# EasyEDA schematic USBMicro_SCH.json
TITLE: Sheet_1; REV: 1.0; Date: 2022-03-17; Sheet: 1/1; Drawn By: Anthony Tricarichi; Company: Your Company
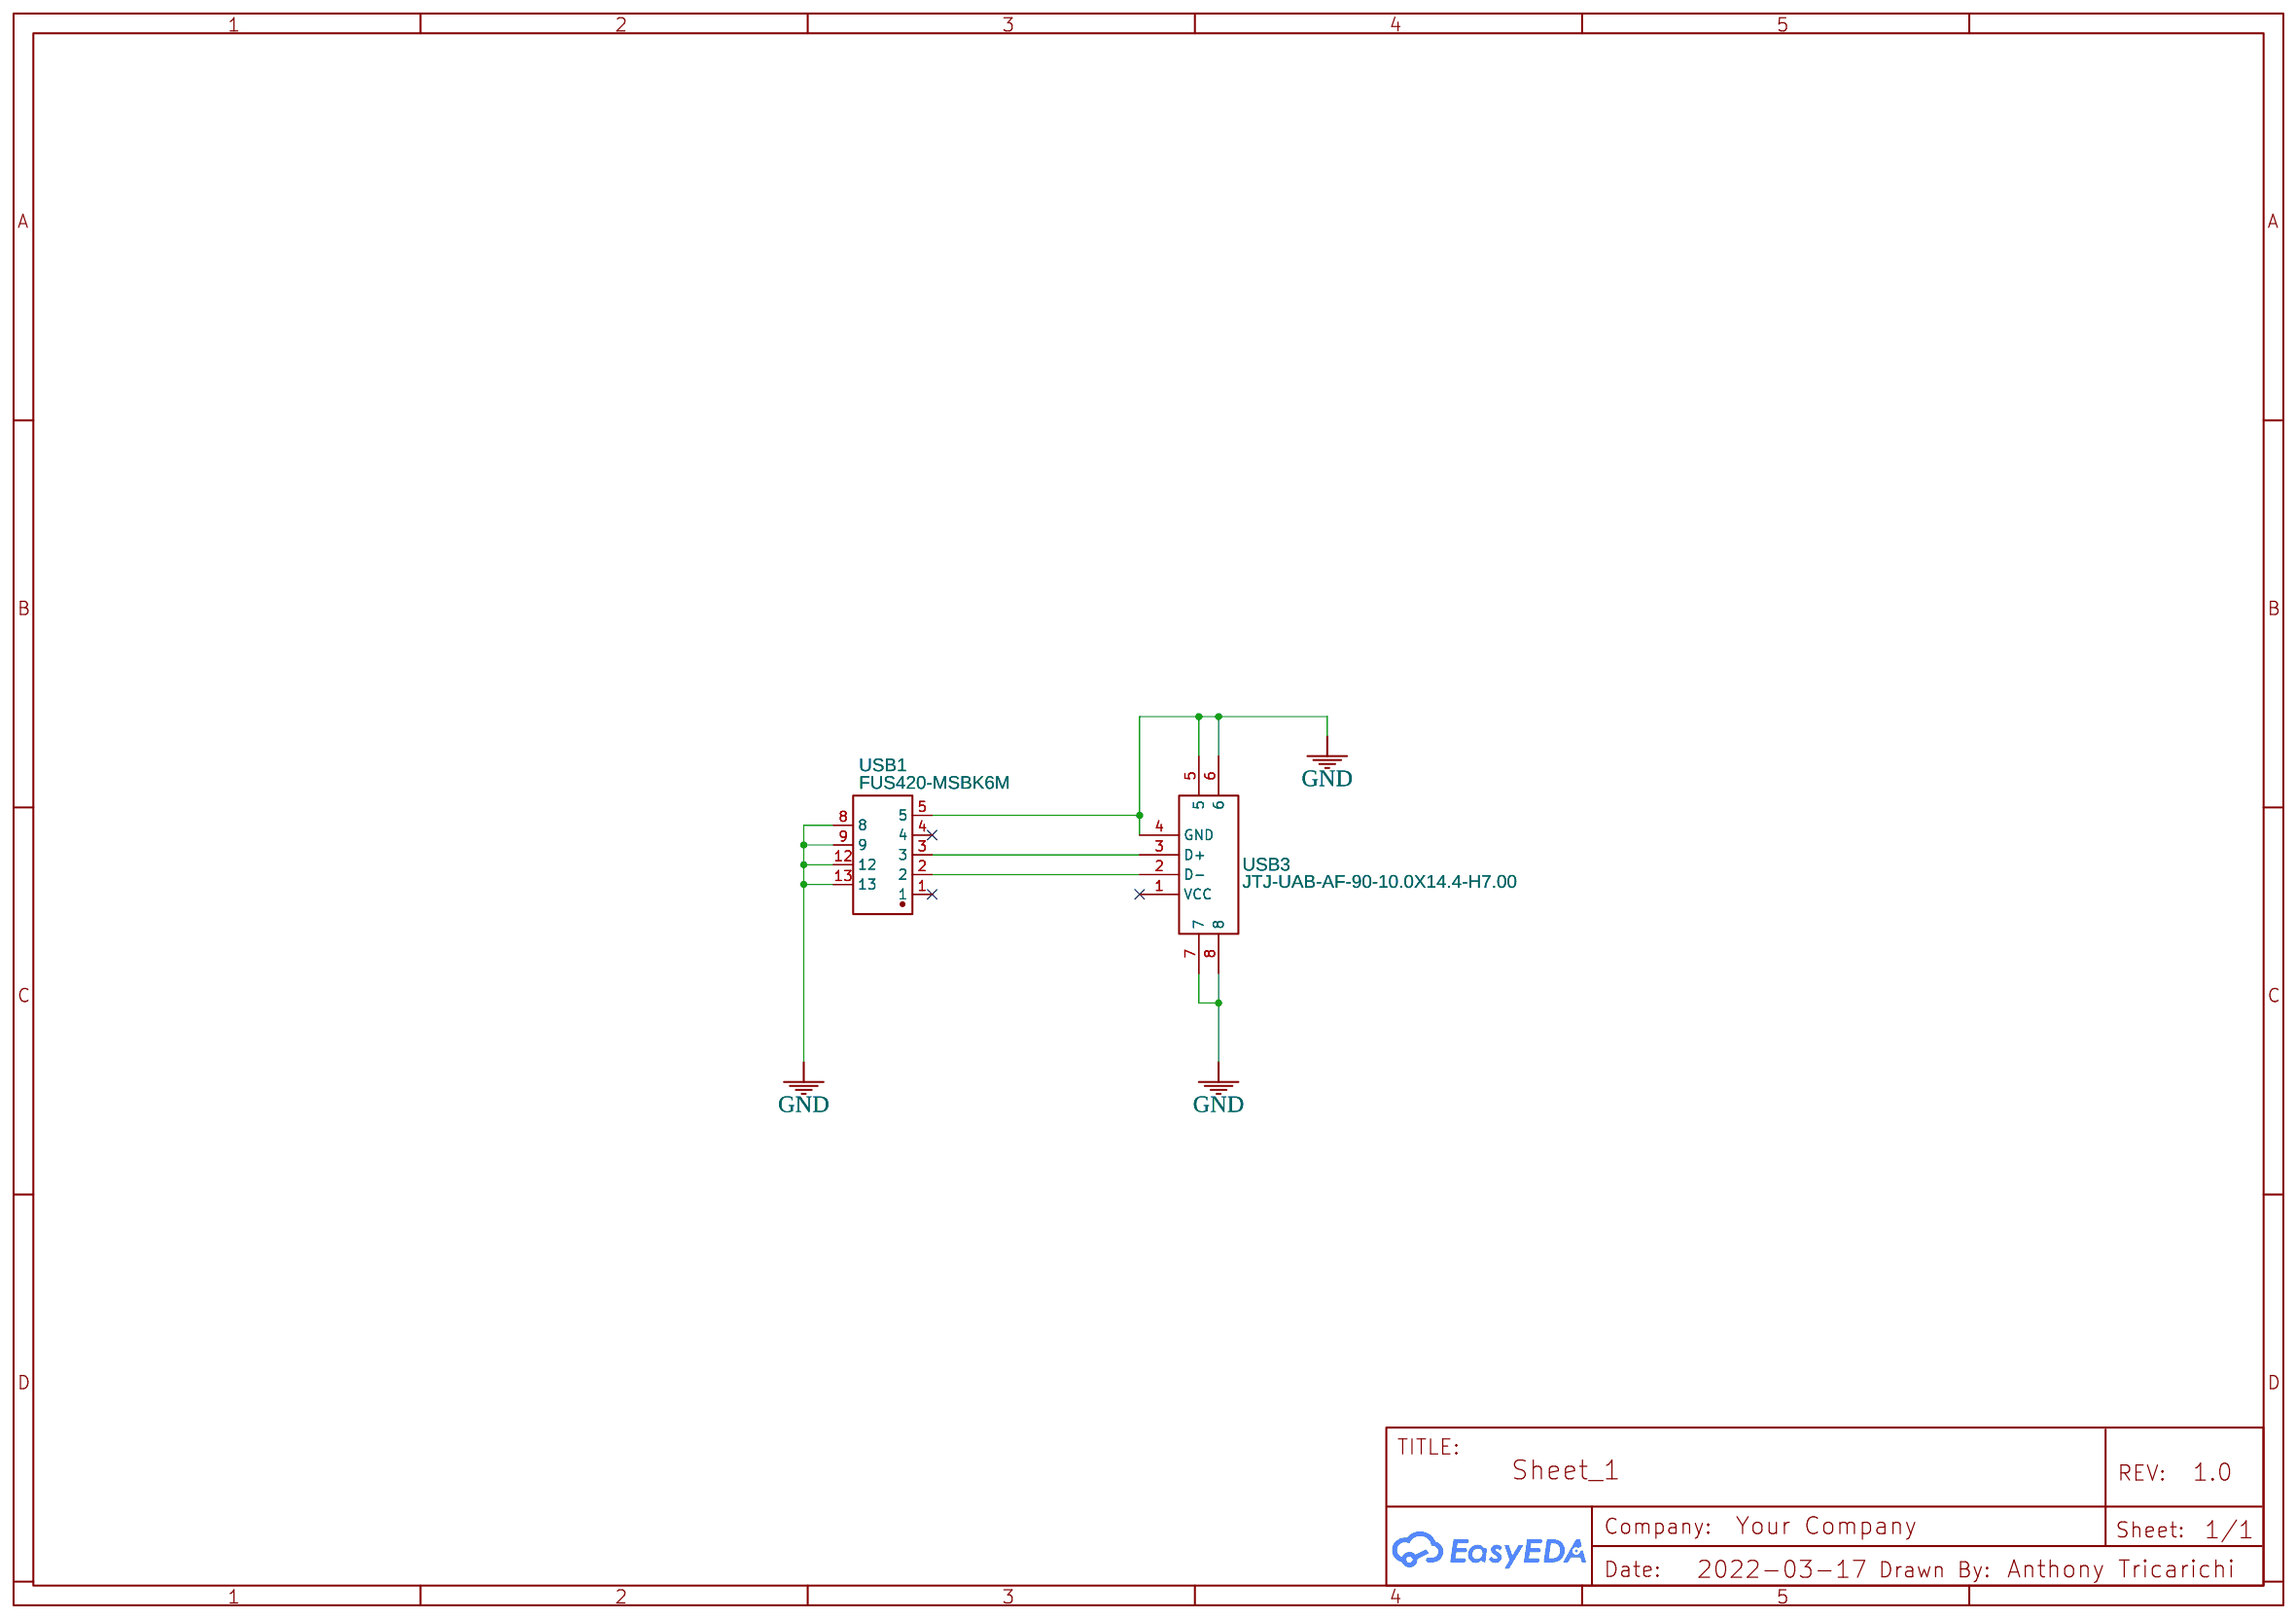
[diagram p0: schematic sheet]

## Parts
USB1  FUS420-MSBK6M  [MICRO-USB-SMD_FUS420-MSBK6M]
USB3  JTJ-UAB-AF-90-10.0X14.4-H7.00  [USB-A-SMD_C42591]

## Library data of the parts
USB1 = FUS420-MSBK6M: Supplier: LCSC; Supplier Part: C2833885; Manufacturer: TXGA(特思嘉); Contributor: LCSC; JLCPCB Part Class: Extended Part
USB3 = JTJ-UAB-AF-90-10.0X14.4-H7.00: Supplier: LCSC; Supplier Part: C42591; Manufacturer: LCSC; Contributor: LCSC; JLCPCB Part Class: Extended Part

## Nets
GND: USB1.5 USB1.8 USB1.9 USB1.12 USB1.13 USB3.4(GND) USB3.5 USB3.6 USB3.7 USB3.8
Net-(USB1-2): USB1.2 USB3.2(D-)
Net-(USB1-3): USB1.3 USB3.3(D+)

Not connected (* = marked no-connect by the designer): USB1 1* 4*; USB3 1(VCC)*
